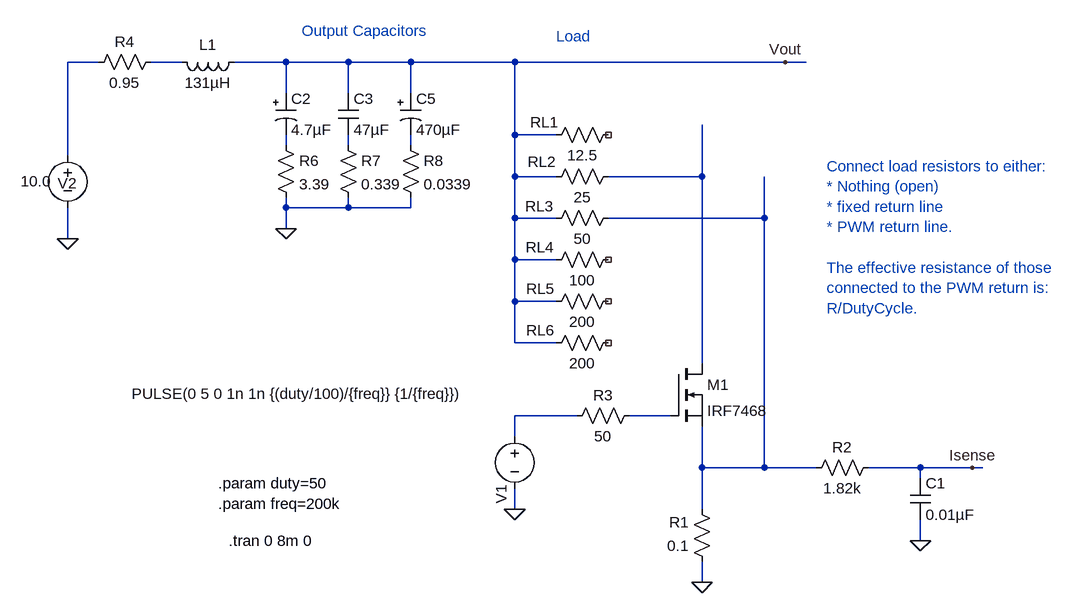
[diagram p0: schematic OL_Adjustable_Load.asc]
OL_Adjustable_Load.asc, the LTspice schematic file:
Version 4
SHEET 1 2776 696
WIRE 304 -464 256 -464
WIRE 432 -464 384 -464
WIRE 592 -464 512 -464
WIRE 688 -464 592 -464
WIRE 784 -464 688 -464
WIRE 944 -464 784 -464
WIRE 1360 -464 944 -464
WIRE 1392 -464 1360 -464
WIRE 592 -416 592 -464
WIRE 688 -416 688 -464
WIRE 784 -416 784 -464
WIRE 944 -352 944 -464
WIRE 1008 -352 944 -352
WIRE 592 -336 592 -352
WIRE 688 -336 688 -352
WIRE 784 -336 784 -352
WIRE 256 -320 256 -464
WIRE 944 -288 944 -352
WIRE 1008 -288 944 -288
WIRE 1232 -288 1232 -368
WIRE 1232 -288 1088 -288
WIRE 592 -240 592 -256
WIRE 688 -240 688 -256
WIRE 688 -240 592 -240
WIRE 784 -240 784 -256
WIRE 784 -240 688 -240
WIRE 944 -224 944 -288
WIRE 1008 -224 944 -224
WIRE 1328 -224 1328 -288
WIRE 1328 -224 1088 -224
WIRE 592 -208 592 -240
WIRE 256 -192 256 -240
WIRE 944 -160 944 -224
WIRE 1008 -160 944 -160
WIRE 944 -96 944 -160
WIRE 1008 -96 944 -96
WIRE 944 -32 944 -96
WIRE 1008 -32 944 -32
WIRE 1232 0 1232 -288
WIRE 1040 80 944 80
WIRE 1184 80 1120 80
WIRE 944 112 944 80
WIRE 1232 160 1232 96
WIRE 1328 160 1328 -224
WIRE 1328 160 1232 160
WIRE 1408 160 1328 160
WIRE 1568 160 1488 160
WIRE 1648 160 1568 160
WIRE 1664 160 1648 160
WIRE 1568 176 1568 160
WIRE 944 224 944 192
WIRE 1232 224 1232 160
WIRE 1568 272 1568 240
WIRE 1232 336 1232 304
FLAG 1232 336 0
FLAG 1360 -464 Vout
FLAG 944 224 0
FLAG 256 -192 0
FLAG 592 -208 0
FLAG 1568 272 0
FLAG 1648 160 Isense
SYMBOL voltage 944 96 R0
WINDOW 123 0 0 Left 2
WINDOW 39 0 0 Left 2
WINDOW 3 -73 -50 Right 2
WINDOW 0 -21 90 VRight 2
SYMATTR Value PULSE(0 5 0 1n 1n {(duty/100)/{freq}} {1/{freq}})
SYMATTR InstName V1
SYMBOL voltage 256 -336 R0
WINDOW 123 0 0 Left 2
WINDOW 39 0 0 Left 2
WINDOW 0 -15 58 Left 2
WINDOW 3 -72 55 Left 2
SYMATTR InstName V2
SYMATTR Value 10.0
SYMBOL res 992 -272 R270
WINDOW 0 23 -6 VTop 2
WINDOW 3 0 56 VBottom 2
SYMATTR InstName RL2
SYMATTR Value 25
SYMBOL cap 672 -416 R0
SYMATTR InstName C3
SYMATTR Value 47µF
SYMBOL polcap 576 -416 R0
SYMATTR InstName C2
SYMATTR Value 4.7µF
SYMBOL nmos 1184 0 R0
SYMATTR InstName M1
SYMATTR Value IRF7468
SYMBOL res 992 -208 R270
WINDOW 0 19 -10 VTop 2
WINDOW 3 0 56 VBottom 2
SYMATTR InstName RL3
SYMATTR Value 50
SYMBOL res 1136 64 R90
WINDOW 0 0 56 VBottom 2
WINDOW 3 32 56 VTop 2
SYMATTR InstName R3
SYMATTR Value 50
SYMBOL polcap 768 -416 R0
SYMATTR InstName C5
SYMATTR Value 470µF
SYMBOL res 576 -352 R0
SYMATTR InstName R6
SYMATTR Value 3.39
SYMBOL res 672 -352 R0
SYMATTR InstName R7
SYMATTR Value 0.339
SYMBOL res 768 -352 R0
SYMATTR InstName R8
SYMATTR Value 0.0339
SYMBOL res 992 -144 R270
WINDOW 0 20 -9 VTop 2
WINDOW 3 0 56 VBottom 2
SYMATTR InstName RL4
SYMATTR Value 100
SYMBOL res 992 -80 R270
WINDOW 0 20 -8 VTop 2
WINDOW 3 0 56 VBottom 2
SYMATTR InstName RL5
SYMATTR Value 200
SYMBOL res 992 -336 R270
WINDOW 0 20 -2 VTop 2
WINDOW 3 0 56 VBottom 2
SYMATTR InstName RL1
SYMATTR Value 12.5
SYMBOL res 992 -16 R270
WINDOW 0 20 -8 VTop 2
WINDOW 3 0 56 VBottom 2
SYMATTR InstName RL6
SYMATTR Value 200
SYMBOL res 1248 320 R180
WINDOW 0 36 76 Left 2
WINDOW 3 36 40 Left 2
SYMATTR InstName R1
SYMATTR Value 0.1
SYMBOL res 1504 144 R90
WINDOW 0 0 56 VBottom 2
WINDOW 3 32 56 VTop 2
SYMATTR InstName R2
SYMATTR Value 1.82k
SYMBOL cap 1552 176 R0
SYMATTR InstName C1
SYMATTR Value 0.01µF
SYMBOL ind 528 -480 R90
WINDOW 0 5 56 VBottom 2
WINDOW 3 32 56 VTop 2
SYMATTR InstName L1
SYMATTR Value 131µH
SYMBOL res 400 -480 R90
WINDOW 0 0 56 VBottom 2
WINDOW 3 32 56 VTop 2
SYMATTR InstName R4
SYMATTR Value 0.95
TEXT 504 272 Left 2 !.tran 0 8m 0
TEXT 488 184 Left 2 !.param duty=50\n.param freq=200k
TEXT 616 -512 Left 2 ;Output Capacitors
TEXT 1008 -504 Left 2 ;Load
TEXT 1424 -304 Left 2 ;Connect load resistors to either:\n* Nothing (open)\n* fixed return line\n* PWM return line.\n \nThe effective resistance of those\nconnected to the PWM return is:\nR/DutyCycle.

The netlist it stands for:
* OL_Adjustable_Load.asc
V1 N008 0 PULSE(0 5 0 1n 1n {(duty/100)/{freq}} {1/{freq}})
V2 N001 0 10.0
RL2 Vout N006 25
C3 Vout N004 47µF
C2 Vout N003 4.7µF
M1 N006 N009 N007 N007 IRF7468
RL3 Vout N007 50
R3 N009 N008 50
C5 Vout N005 470µF
R6 N003 0 3.39
R7 N004 0 0.339
R8 N005 0 0.0339
RL4 Vout NC_01 100
RL5 Vout NC_02 200
RL1 Vout NC_03 12.5
RL6 Vout NC_04 200
R1 0 N007 0.1
R2 Isense N007 1.82k
C1 Isense 0 0.01µF
L1 Vout N002 131µH
R4 N002 N001 0.95
.model NMOS NMOS
.model PMOS PMOS
.lib standard.mos
.tran 0 8m 0
.param duty=50
.param freq=200k
* Output Capacitors
* Load
* Connect load resistors to either:
* * Nothing (open)
* * fixed return line
* * PWM return line.
* The effective resistance of those
* connected to the PWM return is:
* R/DutyCycle.
.backanno
.end